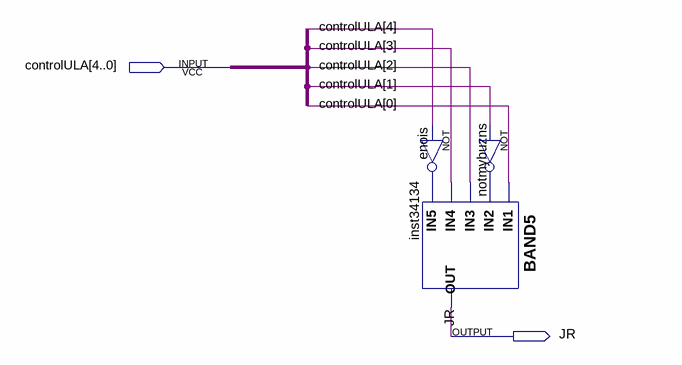
[diagram p0: schematic sheet]
// Quartus schematic controlJR.bdf as structural Verilog: 3 symbols, 2 pins
module controlJR (
  input  [4:0] controlULA,
  output JR
);

  wire enois_out, notmybuzns_out;

  and inst34134 (JR, ~controlULA[0], ~notmybuzns_out, ~controlULA[2], ~controlULA[3], ~enois_out);  // BAND5
  not enois (enois_out, controlULA[4]);
  not notmybuzns (notmybuzns_out, controlULA[1]);
endmodule
